# Altium schematic sheet A7_GND - Ⅱ.SchDoc
size A3
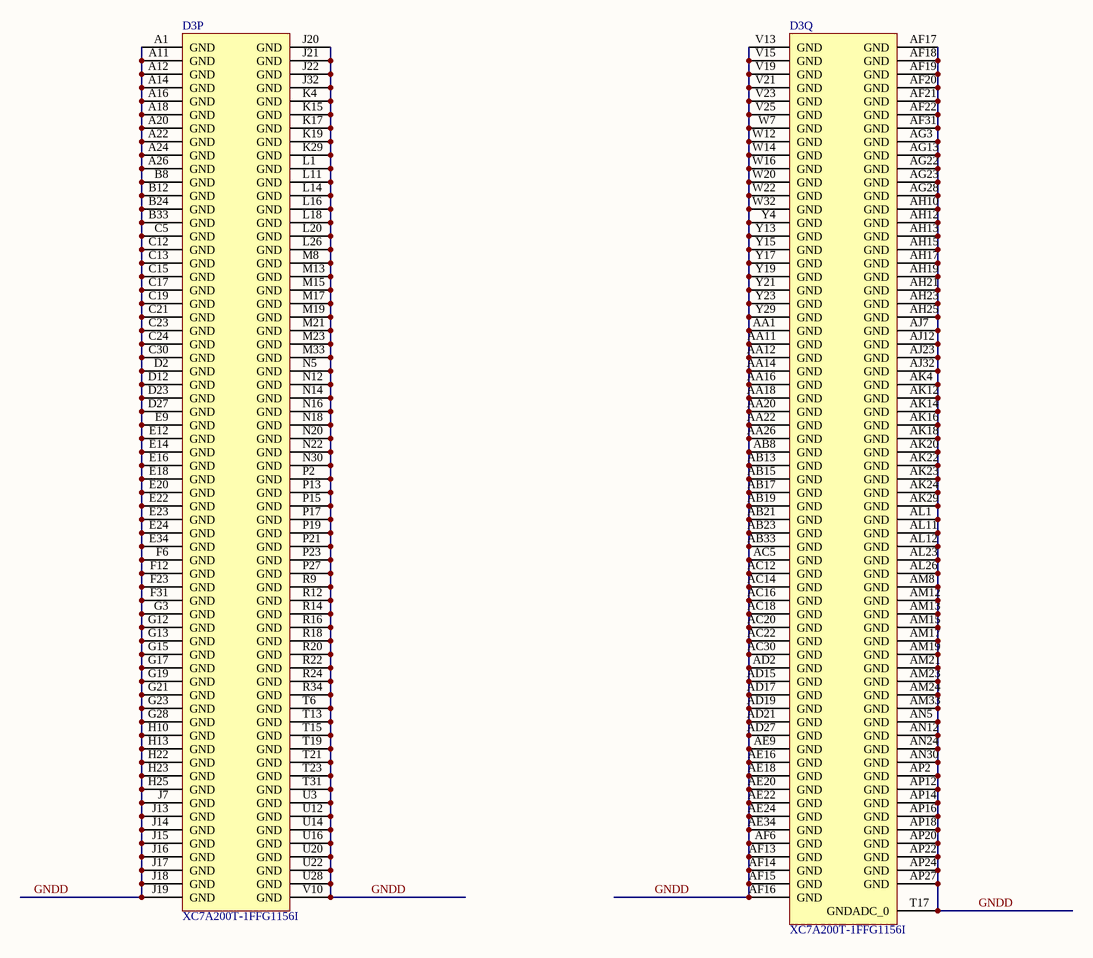
[diagram p0: A7_GND - Ⅱ.SchDoc]

## Parts
D3  XC7A200T-1FFG1156I  [FFG1156]  (parts P,Q of 18)

## Nets
GNDD: D3.A1(GND) D3.A11(GND) D3.A12(GND) D3.A14(GND) D3.A16(GND) D3.A18(GND) D3.A20(GND) D3.A22(GND) D3.A24(GND) D3.A26(GND) D3.AA1(GND) D3.AA11(GND) D3.AA12(GND) D3.AA14(GND) D3.AA16(GND) D3.AA18(GND) D3.AA20(GND) D3.AA22(GND) D3.AA26(GND) D3.AB8(GND) D3.AB13(GND) D3.AB15(GND) D3.AB17(GND) D3.AB19(GND) D3.AB21(GND) D3.AB23(GND) D3.AB33(GND) D3.AC5(GND) D3.AC12(GND) D3.AC14(GND) D3.AC16(GND) D3.AC18(GND) D3.AC20(GND) D3.AC22(GND) D3.AC30(GND) D3.AD2(GND) D3.AD15(GND) D3.AD17(GND) D3.AD19(GND) D3.AD21(GND) D3.AD27(GND) D3.AE9(GND) D3.AE16(GND) D3.AE18(GND) D3.AE20(GND) D3.AE22(GND) D3.AE24(GND) D3.AE34(GND) D3.AF6(GND) D3.AF13(GND) D3.AF14(GND) D3.AF15(GND) D3.AF16(GND) D3.AF17(GND) D3.AF18(GND) D3.AF19(GND) D3.AF20(GND) D3.AF21(GND) D3.AF22(GND) D3.AF31(GND) D3.AG3(GND) D3.AG13(GND) D3.AG22(GND) D3.AG23(GND) D3.AG28(GND) D3.AH10(GND) D3.AH12(GND) D3.AH13(GND) D3.AH15(GND) D3.AH17(GND) D3.AH19(GND) D3.AH21(GND) D3.AH23(GND) D3.AH25(GND) D3.AJ7(GND) D3.AJ12(GND) D3.AJ23(GND) D3.AJ32(GND) D3.AK4(GND) D3.AK12(GND) D3.AK14(GND) D3.AK16(GND) D3.AK18(GND) D3.AK20(GND) D3.AK22(GND) D3.AK23(GND) D3.AK24(GND) D3.AK29(GND) D3.AL1(GND) D3.AL11(GND) D3.AL12(GND) D3.AL23(GND) D3.AL26(GND) D3.AM8(GND) D3.AM12(GND) D3.AM13(GND) D3.AM15(GND) D3.AM17(GND) D3.AM19(GND) D3.AM21(GND) D3.AM23(GND) D3.AM24(GND) D3.AM33(GND) D3.AN5(GND) D3.AN12(GND) D3.AN24(GND) D3.AN30(GND) D3.AP2(GND) D3.AP12(GND) D3.AP14(GND) D3.AP16(GND) D3.AP18(GND) D3.AP20(GND) D3.AP22(GND) D3.AP24(GND) D3.AP27(GND) D3.B8(GND) D3.B12(GND) D3.B24(GND) D3.B33(GND) D3.C5(GND) D3.C12(GND) D3.C13(GND) D3.C15(GND) D3.C17(GND) D3.C19(GND) D3.C21(GND) D3.C23(GND) D3.C24(GND) D3.C30(GND) D3.D2(GND) D3.D12(GND) D3.D23(GND) D3.D27(GND) D3.E9(GND) D3.E12(GND) D3.E14(GND) D3.E16(GND) D3.E18(GND) D3.E20(GND) D3.E22(GND) D3.E23(GND) D3.E24(GND) D3.E34(GND) D3.F6(GND) D3.F12(GND) D3.F23(GND) D3.F31(GND) D3.G3(GND) D3.G12(GND) D3.G13(GND) D3.G15(GND) D3.G17(GND) D3.G19(GND) D3.G21(GND) D3.G23(GND) D3.G28(GND) D3.H10(GND) D3.H13(GND) D3.H22(GND) D3.H23(GND) D3.H25(GND) D3.J7(GND) D3.J13(GND) D3.J14(GND) D3.J15(GND) D3.J16(GND) D3.J17(GND) D3.J18(GND) D3.J19(GND) D3.J20(GND) D3.J21(GND) D3.J22(GND) D3.J32(GND) D3.K4(GND) D3.K15(GND) D3.K17(GND) D3.K19(GND) D3.K29(GND) D3.L1(GND) D3.L11(GND) D3.L14(GND) D3.L16(GND) D3.L18(GND) D3.L20(GND) D3.L26(GND) D3.M8(GND) D3.M13(GND) D3.M15(GND) D3.M17(GND) D3.M19(GND) D3.M21(GND) D3.M23(GND) D3.M33(GND) D3.N5(GND) D3.N12(GND) D3.N14(GND) D3.N16(GND) D3.N18(GND) D3.N20(GND) D3.N22(GND) D3.N30(GND) D3.P2(GND) D3.P13(GND) D3.P15(GND) D3.P17(GND) D3.P19(GND) D3.P21(GND) D3.P23(GND) D3.P27(GND) D3.R9(GND) D3.R12(GND) D3.R14(GND) D3.R16(GND) D3.R18(GND) D3.R20(GND) D3.R22(GND) D3.R24(GND) D3.R34(GND) D3.T6(GND) D3.T13(GND) D3.T15(GND) D3.T17(GNDADC_0) D3.T19(GND) D3.T21(GND) D3.T23(GND) D3.T31(GND) D3.U3(GND) D3.U12(GND) D3.U14(GND) D3.U16(GND) D3.U20(GND) D3.U22(GND) D3.U28(GND) D3.V10(GND) D3.V13(GND) D3.V15(GND) D3.V19(GND) D3.V21(GND) D3.V23(GND) D3.V25(GND) D3.W7(GND) D3.W12(GND) D3.W14(GND) D3.W16(GND) D3.W20(GND) D3.W22(GND) D3.W32(GND) D3.Y4(GND) D3.Y13(GND) D3.Y15(GND) D3.Y17(GND) D3.Y19(GND) D3.Y21(GND) D3.Y23(GND) D3.Y29(GND)

## Library data of the parts
D3 = XC7A200T-1FFG1156I: Artix-7 FPGA, 500 User I/Os, 16 GTP, 1156-Ball BGA, Speed Grade 1, Industrial Grade, Pb-Free; Manufacturer: Xilinx; Block RAM Blocks (18Kb): 730; Block RAM Blocks (36Kb): 365; Block RAM Blocks (Max Kb): 13140; CLBs (Slices): 33650; Clock Mgmt Tiles (CMTs): 10; DSP48E1 Slices: 740; Logic Cells: 215360; Max User I/O: 500; Speed Grade: -1; DatasheetVersion: v1.12; PackageVersion: Rev 1.8; PackageReference: FFG1156; PackageDescription: Flip-Chip BGA, Body 35 x 35 mm, 1.0 mm Pitch; CLBs (Max Distributed RAM Kb): 2888; Generic Part Number: XC7A200T; RoHS: Pb-Free; Mounting Technology: Surface Mount; Code_JEDEC: MS-034-AAR-1; PartNumber: XC7A200T-1FFG1156I; ComponentLink1Description: Datasheet; ComponentLink1URL: http://www.xilinx.com/support/documentation/data_sheets/ds180_7Series_Overview.pdf; ComponentLink2Description: Package Specification; ComponentLink2URL: http://www.xilinx.com/support/documentation/user_guides/ug475_7Series_Pkg_Pinout.pdf; ComponentLink3Description: DC and Switching Characteristics; ComponentLink3URL: http://www.xilinx.com/support/documentation/data_sheets/ds181_Artix_7_Data_Sheet.pdf; ComponentLink4Description: Package File; ComponentLink4URL: http://www.xilinx.com/support/packagefiles/a7packages/xc7a200tfbg676pkg.txt; ComponentLink5Description: Packaging and Pinout; ComponentLink5URL: http://www.xilinx.com/support/documentation/user_guides/ug475_7Series_Pkg_Pinout.pdf